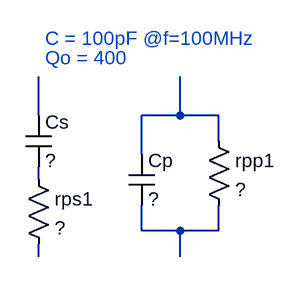
[diagram p0: schematic Capacitor.asc]
Capacitor.asc, the LTspice schematic file:
Version 4
SHEET 1 880 680
WIRE -192 16 -192 -32
WIRE -16 16 -16 -32
WIRE -16 16 -64 16
WIRE 32 16 -16 16
WIRE 32 48 32 16
WIRE -64 64 -64 16
WIRE -192 96 -192 80
WIRE -64 160 -64 128
WIRE -16 160 -64 160
WIRE 32 160 32 128
WIRE 32 160 -16 160
WIRE -192 192 -192 176
WIRE -16 192 -16 160
SYMBOL res -208 80 R0
SYMATTR InstName rps1
SYMATTR Value ?
SYMBOL res 16 32 R0
SYMATTR InstName rpp1
SYMATTR Value ?
SYMBOL cap -208 16 R0
SYMATTR InstName Cs
SYMATTR Value ?
SYMBOL cap -80 64 R0
SYMATTR InstName Cp
SYMATTR Value ?
TEXT -184 -56 Left 2 ;Qo = 400
TEXT -184 -80 Left 2 ;C = 100pF @f=100MHz

The netlist it stands for:
* Capacitor.asc
rps1 N003 N005 ?
rpp1 N002 N004 ?
Cs N001 N003 ?
Cp N002 N004 ?
* Qo = 400
* C = 100pF @f=100MHz
.backanno
.end